# Altium schematic sheet Sensor_Coup_Amp.SchDoc
size A4
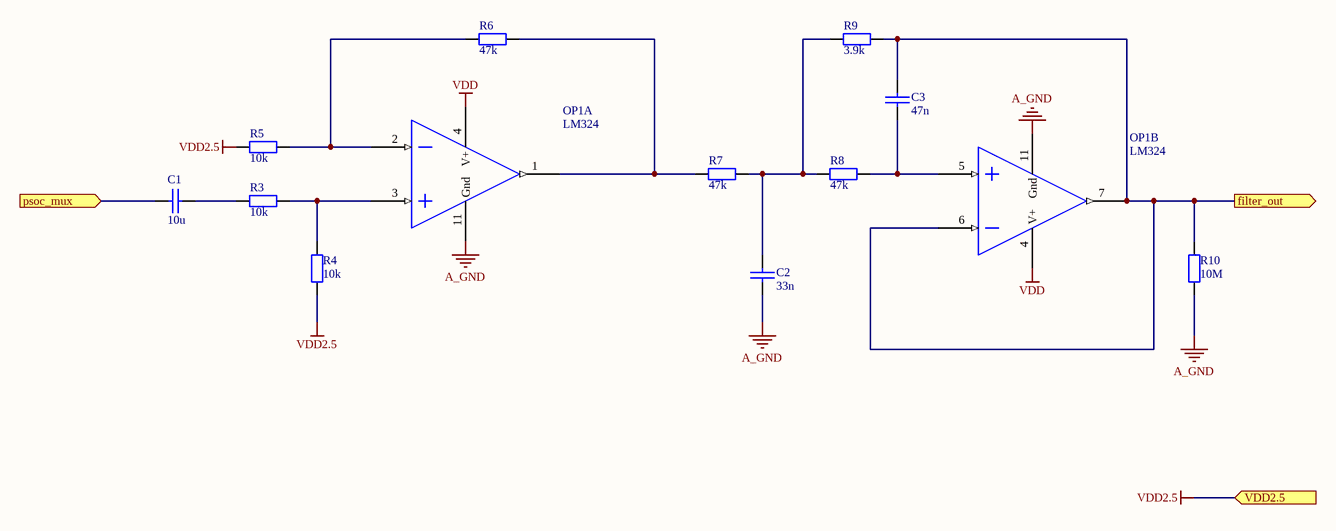
[diagram p0: Sensor_Coup_Amp.SchDoc]

## Parts
C1  10u
C2  33n
C3  47n
OP1  LM324  (parts A,B of 4)
R3  10k
R4  10k
R5  10k
R6  47k
R7  47k
R8  47k
R9  3.9k
R10  10M

## Ports
filter_out (out), psoc_mux (in), VDD2.5 (in)

## Nets
A_GND: C2.1 OP1.11(Gnd) R10.1
VDD: OP1.4(V+)
VDD2.5: R4.1 R5.1 ; port VDD2.5
filter_out: C3.2 OP1.6(IN2(-)) OP1.7(OUT2) R9.2 R10.2 ; port filter_out
psoc_mux: C1.1 ; port psoc_mux
NetC1_2: C1.2 R3.1
NetC2_2: C2.2 R7.2 R8.1 R9.1
NetC3_1: C3.1 OP1.5(IN2+)) R8.2
NetOP1_1: OP1.1(OUT1) R6.2 R7.1
NetOP1_2: OP1.2(IN1(-)) R5.2 R6.1
NetOP1_3: OP1.3(IN1(+)) R3.2 R4.2

## Library data of the parts
C1-C3 = Cap: Capacitor; Value: *
R3-R10 = Resistor: Value: *